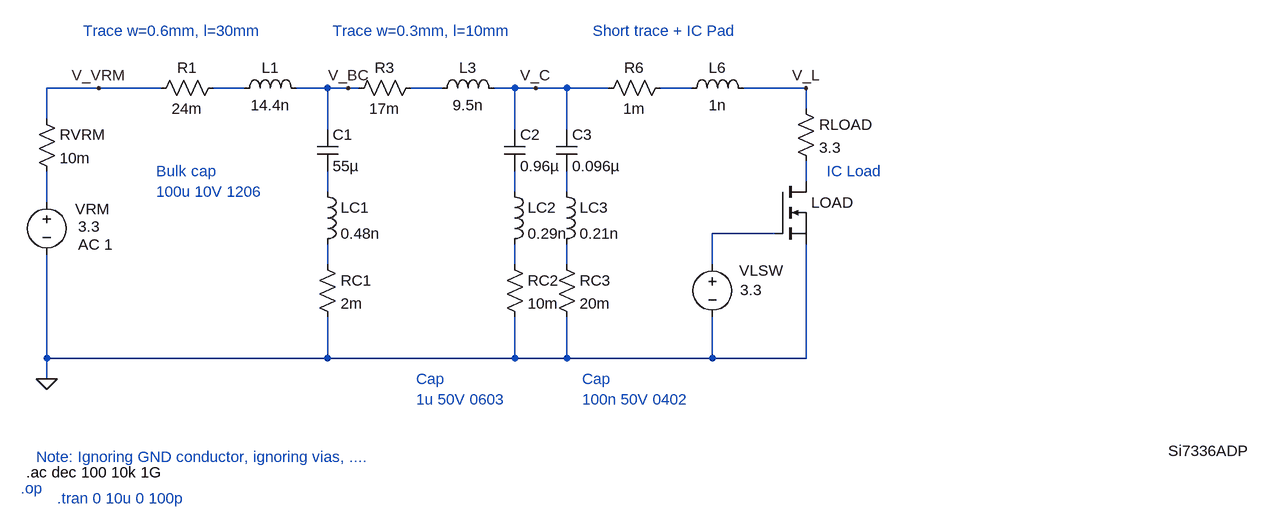
[diagram p0: schematic ADHWD_PDN_Simulation.asc]
ADHWD_PDN_Simulation.asc, the LTspice schematic file:
Version 4.1
SHEET 1 1952 680
WIRE 176 -64 96 -64
WIRE 272 -64 176 -64
WIRE 400 -64 352 -64
WIRE 528 -64 480 -64
WIRE 560 -64 528 -64
WIRE 576 -64 560 -64
WIRE 704 -64 656 -64
WIRE 816 -64 784 -64
WIRE 848 -64 816 -64
WIRE 896 -64 848 -64
WIRE 960 -64 896 -64
WIRE 1088 -64 1040 -64
WIRE 1264 -64 1168 -64
WIRE 1264 -32 1264 -64
WIRE 96 -16 96 -64
WIRE 528 0 528 -64
WIRE 816 0 816 -64
WIRE 896 0 896 -64
WIRE 1264 80 1264 48
WIRE 528 96 528 64
WIRE 816 96 816 64
WIRE 896 96 896 64
WIRE 96 112 96 64
WIRE 1216 160 1120 160
WIRE 528 208 528 176
WIRE 816 208 816 176
WIRE 896 208 896 176
WIRE 1120 208 1120 160
WIRE 96 352 96 192
WIRE 528 352 528 288
WIRE 528 352 96 352
WIRE 816 352 816 288
WIRE 816 352 528 352
WIRE 896 352 896 288
WIRE 896 352 816 352
WIRE 1120 352 1120 288
WIRE 1120 352 896 352
WIRE 1264 352 1264 176
WIRE 1264 352 1120 352
WIRE 96 384 96 352
FLAG 96 384 0
FLAG 1264 -64 V_L
FLAG 848 -64 V_C
FLAG 560 -64 V_BC
FLAG 176 -64 V_VRM
SYMBOL voltage 96 96 R0
WINDOW 0 44 26 Left 2
WINDOW 3 48 53 Left 2
WINDOW 123 48 81 Left 2
WINDOW 39 0 0 Left 0
SYMATTR InstName VRM
SYMATTR Value 3.3
SYMATTR Value2 AC 1
SYMBOL res 80 -32 R0
SYMATTR InstName RVRM
SYMATTR Value 10m
SYMBOL res 368 -80 R90
WINDOW 0 0 56 VBottom 2
WINDOW 3 32 56 VTop 2
SYMATTR InstName R1
SYMATTR Value 24m
SYMBOL ind 384 -48 R270
WINDOW 0 32 56 VTop 2
WINDOW 3 5 56 VBottom 2
SYMATTR InstName L1
SYMATTR Value 14.4n
SYMBOL ind 512 80 R0
SYMATTR InstName LC1
SYMATTR Value 0.48n
SYMBOL res 512 192 R0
SYMATTR InstName RC1
SYMATTR Value 2m
SYMBOL res 672 -80 R90
WINDOW 0 0 56 VBottom 2
WINDOW 3 32 56 VTop 2
SYMATTR InstName R3
SYMATTR Value 17m
SYMBOL ind 688 -48 R270
WINDOW 0 32 56 VTop 2
WINDOW 3 5 56 VBottom 2
SYMATTR InstName L3
SYMATTR Value 9.5n
SYMBOL cap 800 0 R0
SYMATTR InstName C2
SYMATTR Value 0.96µ
SYMBOL cap 880 0 R0
SYMATTR InstName C3
SYMATTR Value 0.096µ
SYMBOL ind 800 80 R0
SYMATTR InstName LC2
SYMATTR Value 0.29n
SYMBOL ind 880 80 R0
SYMATTR InstName LC3
SYMATTR Value 0.21n
SYMBOL res 800 192 R0
SYMATTR InstName RC2
SYMATTR Value 10m
SYMBOL res 880 192 R0
SYMATTR InstName RC3
SYMATTR Value 20m
SYMBOL res 1056 -80 R90
WINDOW 0 0 56 VBottom 2
WINDOW 3 32 56 VTop 2
SYMATTR InstName R6
SYMATTR Value 1m
SYMBOL ind 1072 -48 R270
WINDOW 0 32 56 VTop 2
WINDOW 3 5 56 VBottom 2
SYMATTR InstName L6
SYMATTR Value 1n
SYMBOL nmos 1216 80 R0
WINDOW 3 605 415 Left 2
SYMATTR Value Si7336ADP
SYMATTR InstName LOAD
SYMBOL voltage 1120 192 R0
WINDOW 0 41 25 Left 2
WINDOW 3 43 55 Left 2
WINDOW 123 0 0 Left 0
WINDOW 39 0 0 Left 0
SYMATTR InstName VLSW
SYMATTR Value 3.3
SYMBOL cap 512 0 R0
SYMATTR InstName C1
SYMATTR Value 55µ
SYMBOL res 1248 -48 R0
SYMATTR InstName RLOAD
SYMATTR Value 3.3
TEXT 536 -152 Left 2 ;Trace w=0.3mm, l=10mm
TEXT 152 -152 Left 2 ;Trace w=0.6mm, l=30mm
TEXT 936 -152 Left 2 ;Short trace + IC Pad
TEXT 264 64 Left 2 ;Bulk cap\n100u 10V 1206
TEXT 664 384 Left 2 ;Cap\n1u 50V 0603
TEXT 1296 64 Left 2 ;IC Load
TEXT 80 504 Left 2 ;Note: Ignoring GND conductor, ignoring vias, ....
TEXT 920 384 Left 2 ;Cap\n100n 50V 0402
TEXT 64 528 Left 2 !.ac dec 100 10k 1G
TEXT 56 552 Left 2 ;.op
TEXT 112 568 Left 2 ;.tran 0 10u 0 100p

The netlist it stands for:
* ADHWD_PDN_Simulation.asc
VRM N008 0 3.3 AC 1
RVRM V_VRM N008 10m
R1 N001 V_VRM 24m
L1 N001 V_BC 14.4n
LC1 N005 N010 0.48n
RC1 N010 0 2m
R3 N002 V_BC 17m
L3 N002 V_C 9.5n
C2 V_C N006 0.96µ
C3 V_C N007 0.096µ
LC2 N006 N011 0.29n
LC3 N007 N012 0.21n
RC2 N011 0 10m
RC3 N012 0 20m
R6 N003 V_C 1m
L6 N003 V_L 1n
M§LOAD N004 N009 0 0 Si7336ADP
VLSW N009 0 3.3
C1 V_BC N005 55µ
RLOAD V_L N004 3.3
.model NMOS NMOS
.model PMOS PMOS
.lib standard.mos
* Trace w=0.3mm, l=10mm
* Trace w=0.6mm, l=30mm
* Short trace + IC Pad
* Bulk cap
* 100u 10V 1206
* Cap
* 1u 50V 0603
* IC Load
* Note: Ignoring GND conductor, ignoring vias, ....
* Cap
* 100n 50V 0402
.ac dec 100 10k 1G
* .op
* .tran 0 10u 0 100p
.backanno
.end